# Altium schematic sheet obc-v2_MCU-POWER.SchDoc
size 420 x 297 mm; SheetNumber: 22; SheetTotal: 23
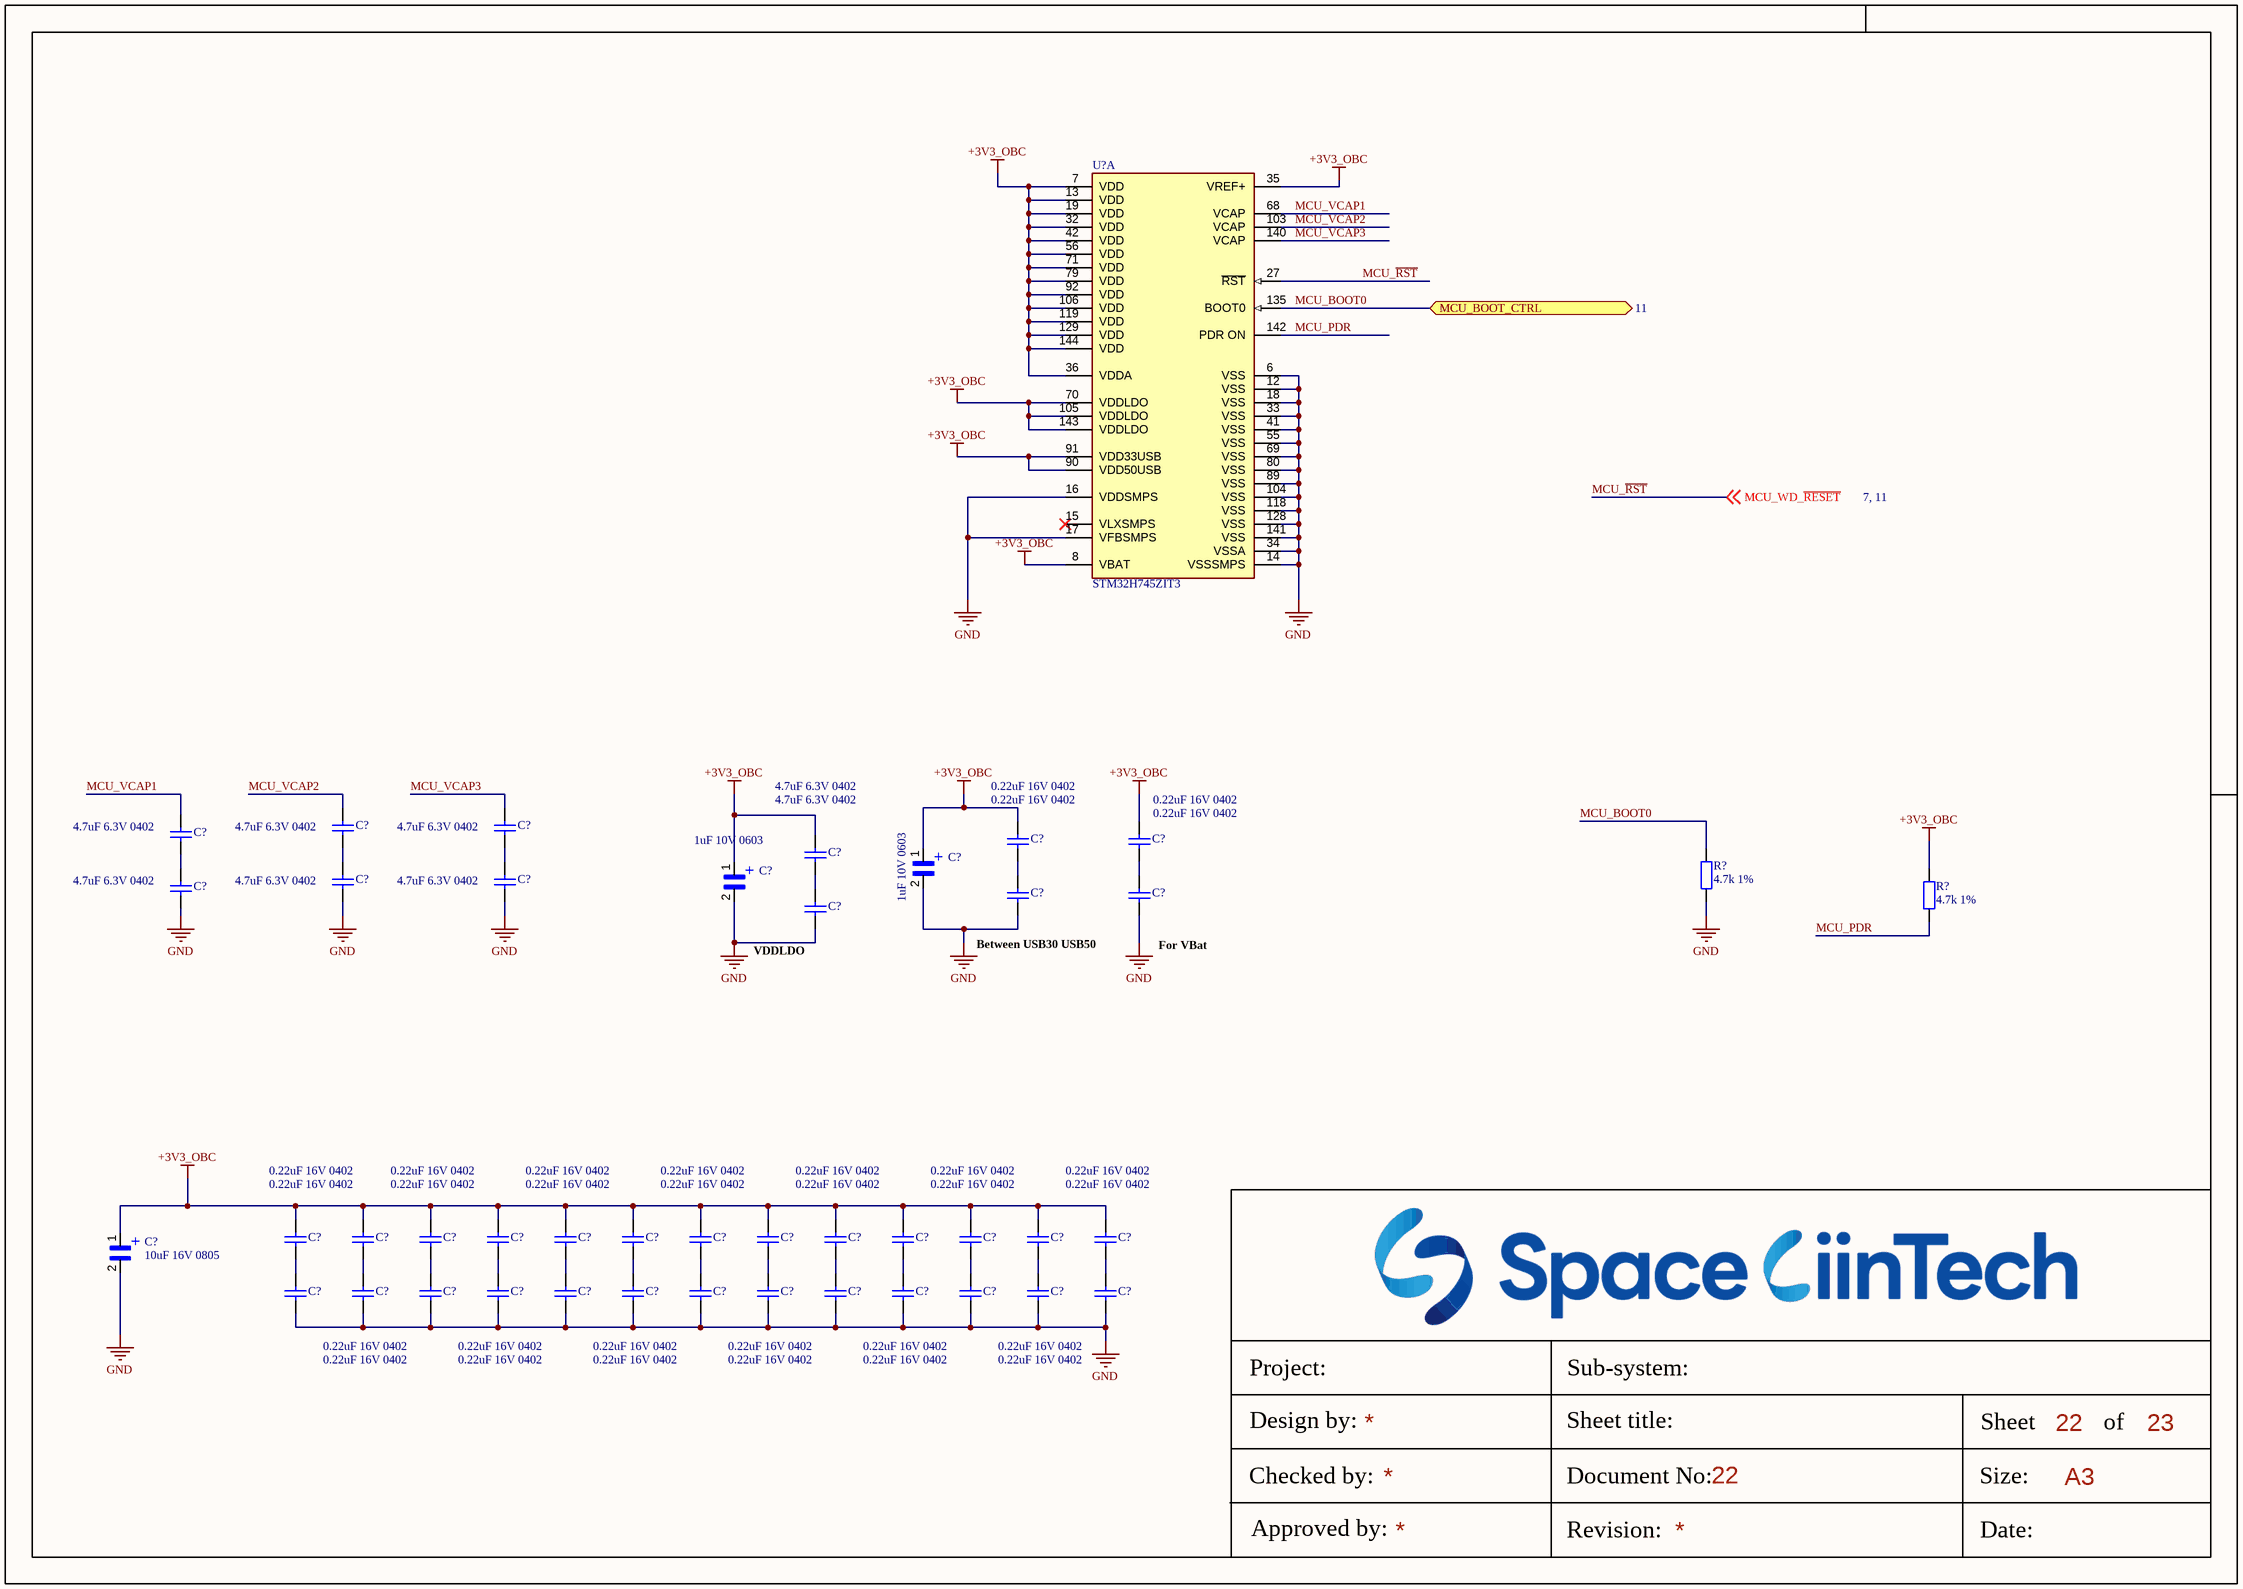
[diagram p0: obc-v2_MCU-POWER.SchDoc]

## Parts
(Parts that share a designator on the sheet are numbered #1, #2 ... from top to bottom, then left to right.)
C?#1  4.7uF 6.3V 0402  [tu 0402]
C?#2  4.7uF 6.3V 0402  [tu 0402]
C?#3  4.7uF 6.3V 0402  [tu 0402]
C?#4  0.22uF 16V 0402  [tu 0402]
C?#5  0.22uF 16V 0402  [tu 0402]
C?#6  4.7uF 6.3V 0402  [tu 0402]
C?#7  1uF 10V 0603  [CAPC1608X90]
C?#8  4.7uF 6.3V 0402  [tu 0402]
C?#9  4.7uF 6.3V 0402  [tu 0402]
C?#10  4.7uF 6.3V 0402  [tu 0402]
C?#11  1uF 10V 0603  [CAPC1608X90]
C?#12  0.22uF 16V 0402  [tu 0402]
C?#13  0.22uF 16V 0402  [tu 0402]
C?#14  4.7uF 6.3V 0402  [tu 0402]
C?#15  0.22uF 16V 0402  [tu 0402]
C?#16  0.22uF 16V 0402  [tu 0402]
C?#17  0.22uF 16V 0402  [tu 0402]
C?#18  0.22uF 16V 0402  [tu 0402]
C?#19  0.22uF 16V 0402  [tu 0402]
C?#20  0.22uF 16V 0402  [tu 0402]
C?#21  0.22uF 16V 0402  [tu 0402]
C?#22  0.22uF 16V 0402  [tu 0402]
C?#23  0.22uF 16V 0402  [tu 0402]
C?#24  0.22uF 16V 0402  [tu 0402]
C?#25  0.22uF 16V 0402  [tu 0402]
C?#26  0.22uF 16V 0402  [tu 0402]
C?#27  0.22uF 16V 0402  [tu 0402]
C?#28  10uF 16V 0805  [CAPC2012X140N]
C?#29  0.22uF 16V 0402  [tu 0402]
C?#30  0.22uF 16V 0402  [tu 0402]
C?#31  0.22uF 16V 0402  [tu 0402]
C?#32  0.22uF 16V 0402  [tu 0402]
C?#33  0.22uF 16V 0402  [tu 0402]
C?#34  0.22uF 16V 0402  [tu 0402]
C?#35  0.22uF 16V 0402  [tu 0402]
C?#36  0.22uF 16V 0402  [tu 0402]
C?#37  0.22uF 16V 0402  [tu 0402]
C?#38  0.22uF 16V 0402  [tu 0402]
C?#39  0.22uF 16V 0402  [tu 0402]
C?#40  0.22uF 16V 0402  [tu 0402]
C?#41  0.22uF 16V 0402  [tu 0402]
R?#1  4.7k 1%  [tro smd 0603]
R?#2  4.7k 1%  [tro smd 0603]
U?  STM32H745ZIT3  [FP-LQFP144-1A-MFG]  (part A of 3)

## Ports
MCU_BOOT_CTRL (bidir, see 11)

## Nets
+3V3_OBC: C?#4.1 C?#5.1 C?#6.1 C?#7.1 C?#11.1 C?#15.1 C?#16.1 C?#17.1 C?#18.1 C?#19.1 C?#20.1 C?#21.1 C?#22.1 C?#23.1 C?#24.1 C?#25.1 C?#26.1 C?#27.1 C?#28.1 R?#2.1 U?.7(VDD) U?.8(VBAT) U?.13(VDD) U?.19(VDD) U?.32(VDD) U?.35(VREF+) U?.36(VDDA) U?.42(VDD) U?.56(VDD) U?.70(VDDLDO) U?.71(VDD) U?.79(VDD) U?.90(VDD50USB) U?.91(VDD33USB) U?.92(VDD) U?.105(VDDLDO) U?.106(VDD) U?.119(VDD) U?.129(VDD) U?.143(VDDLDO) U?.144(VDD)
GND: C?#7.2 C?#8.2 C?#9.2 C?#10.2 C?#11.2 C?#12.2 C?#13.2 C?#14.2 C?#28.2 C?#29.2 C?#30.2 C?#31.2 C?#32.2 C?#33.2 C?#34.2 C?#35.2 C?#36.2 C?#37.2 C?#38.2 C?#39.2 C?#40.2 C?#41.2 R?#1.1 U?.6(VSS) U?.12(VSS) U?.14(VSSSMPS) U?.16(VDDSMPS) U?.17(VFBSMPS) U?.18(VSS) U?.33(VSS) U?.34(VSSA) U?.41(VSS) U?.55(VSS) U?.69(VSS) U?.80(VSS) U?.89(VSS) U?.104(VSS) U?.118(VSS) U?.128(VSS) U?.141(VSS)
MCU_BOOT0: R?#1.2 U?.135(BOOT0) ; port MCU_BOOT_CTRL
MCU_PDR: R?#2.2 U?.142(PDR_ON)
MCU_~{RST}: U?.27(~{RST}) ; off-sheet MCU_WD_~{RESET}  [also labelled MCU_WD_~{RESET}]
MCU_VCAP1: C?#3.1 U?.68(VCAP)
MCU_VCAP2: C?#1.1 U?.103(VCAP)
MCU_VCAP3: C?#2.1 U?.140(VCAP)
NetC?#1_2: C?#1.2 C?#8.1
NetC?#2_2: C?#2.2 C?#9.1
NetC?#3_2: C?#3.2 C?#10.1
NetC?#4_2: C?#4.2 C?#12.1
NetC?#5_2: C?#5.2 C?#13.1
NetC?#6_2: C?#6.2 C?#14.1
NetC?#15_2: C?#15.2 C?#29.1
NetC?#16_2: C?#16.2 C?#30.1
NetC?#17_2: C?#17.2 C?#31.1
NetC?#18_2: C?#18.2 C?#32.1
NetC?#19_2: C?#19.2 C?#33.1
NetC?#20_2: C?#20.2 C?#34.1
NetC?#21_2: C?#21.2 C?#35.1
NetC?#22_2: C?#22.2 C?#36.1
NetC?#23_2: C?#23.2 C?#37.1
NetC?#24_2: C?#24.2 C?#38.1
NetC?#25_2: C?#25.2 C?#39.1
NetC?#26_2: C?#26.2 C?#40.1
NetC?#27_2: C?#27.2 C?#41.1

Not connected (* = marked no-connect by the designer): U? 15(VLXSMPS)*

## Notes on the sheet
- (near C?#14) VDDLDO
- (near C?#12) Between USB30 USB50
- (near C?#13) For VBat
- Project:
- Sub-system:
- Design by:
- Sheet title:
- Sheet
- A3
- of
- Checked by:
- Approved by:
- Revision:
- Document No:
- Size:
- Date:
- (in symbol TACL335M003RTA) +
- (in symbol TACR686M003RTA) +

## Library data of the parts
C?#1-C?#3 C?#6 C?#8-C?#10 C?#14 = Tu 0402 33nF 10V: 4.7 µF ±20% 6.3V Ceramic Capacitor X7T 0402 (1005 Metric): GRT155D70J475ME13J; Chung_Loai: Dán; Don_Vi: Con; So_Chan: 2; Ten_Linh_Kien: Tụ 0402 33nF X7R 10V GRM155R71A333KA01D; Ma_Hang: MH007853; Kieu_Chan: *
C?#4 C?#5 C?#12 C?#13 C?#15-C?#27 C?#29-C?#41 = Tu 0402 33nF 10V: 0.22 µF ±10% 16V Ceramic Capacitor X7R 0402 (1005 Metric): GCM155R71C224KE02D; Chung_Loai: Dán; Don_Vi: Con; So_Chan: 2; Ten_Linh_Kien: Tụ 0402 33nF X7R 10V GRM155R71A333KA01D; Ma_Hang: MH007853; Kieu_Chan: *
C?#7 C?#11 = TACL335M003RTA: 1 µF Molded Tantalum Capacitors 10 V 0603 (1608 Metric) 12Ohm @ 100kHz: TP8M105M010C; Package: None; Price: None; Value: *; MP: TACL335M003RTA; Availability: Unavailable
C?#28 = TACR686M003RTA: 10 µF Molded Tantalum Capacitors 16 V 0805 (2012 Metric) 8Ohm @ 100kHz: TP8R106M016C; MF: AVX; Availability: Unavailable; SnapEDA_Link: https://www.snapeda.com/parts/TACR686M003RTA/AVX/view-part/1745975/?ref=snap; MP: TACR686M003RTA; Value: *; Price: None; Package: 0805 AVX
R?#1 R?#2 = Tro 0603 1% 10k: RES 4.7K OHM 1% 1/10W 0603, P/N: ERJ-U03F4701V; Chung_Loai: Dán; Don_Vi: Con; So_Chan: 2; Ten_Linh_Kien: Trở 0603 1% 10k; Ma_Hang: MH006333; Kieu_Chan: *
U? = CMP-12105-000054-1: HIGH-PERFORMANCE AND DSP WITH DP; Manufacturer Part Number: STM32H745ZIT6; Manufacturer: STMicroelectronics; Number Of Timers/Counters: 20; Min Supply Voltage: 1.62V; Frequency: 480MHz; Number Of I2C Channels: 4; Memory Type: FLASH; Number Of I/Os: 97; Number Of Pwm Channels: 42; Number Of Usb Channels: 2; Ram Size: 1MBytes; Memory Size: 2MBytes; Data Bus Width: 32bits; Number Of Adc Channels: 23; Number Of Ethernet Channels: 1; Number Of Uart Channels: 9; Interface: I2C,SPI,UART,USART,CAN,USB,LIN,IrDA,Ethernet,I2S,Other; Number Of A/D Converters: 3; Max Junction Temp: +125°C; Max Supply Voltage: 3.6V; Core Architecture: ARM Cortex-M4, Cortex-M7; Number Of Spi Channels: 6; Standoff Height: 0.05mm; Ambient Temperature Range Low: -40°C; Lead Free: Yes; Automotive: No; Height: 1.6mm; Device Class L1: Integrated Circuits (ICs); Ambient Temperature Range High: +85°C; RoHS: TRUE; Temperature Range High: +125°C; Temperature: -40°C to +125°C; Category: IC; Device Class L2: Embedded Processors and Controllers; Number Of Cores: 2; Temperature Range Low: -40°C; Octopart: https://octopart.com/stm32h745zit6-stmicroelectronics-100293939; Digikey Description: HIGH-PERFORMANCE AND DSP WITH DP; Package: LQFP144-1A; Device Class L3: Microcontrollers; ComponentLink2URL: https://www.st.com/resource/en/datasheet/stm32h745zi.pdf; ComponentLink2Description: Datasheet